# Altium schematic sheet wireless.SchDoc: Bison-Board
size A4; DrawnBy: mzy2364; Revision: V1.4
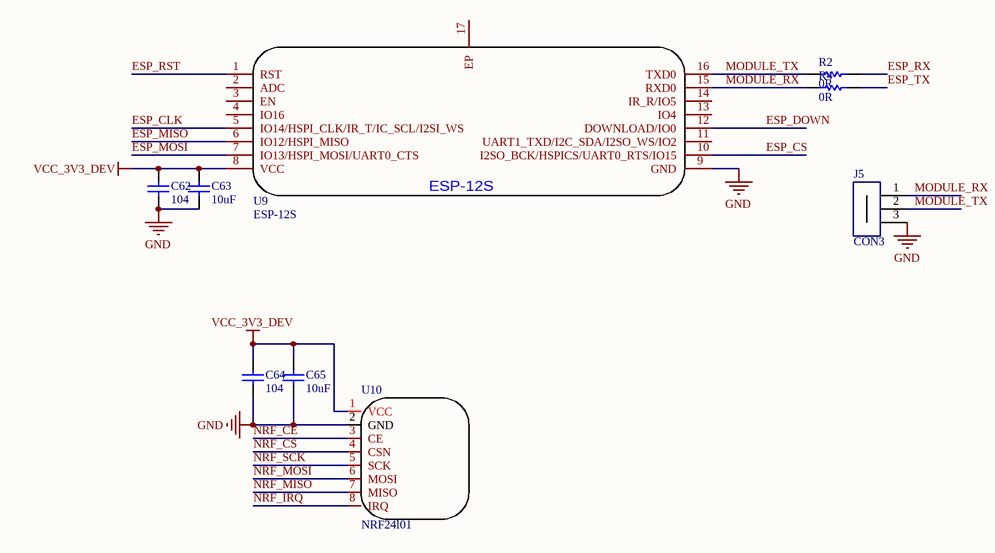
[diagram p0: wireless.SchDoc]

## Parts
C62  104  [C 0603]
C63  10uF  [C 0603]
C64  104  [C 0603]
C65  10uF  [C 0603]
J5  CON3  [SMD_3P-1.25]
R2  0R  [R 0603]
R4  0R  [R 0603]
U9  ESP-12S  [ESP-12S]
U10  NRF24l01  [NRF24l01]

## Nets
GND: C62.2 C63.2 C64.2 C65.2 J5.3 U9.9(GND) U10.2(GND)
VCC_3V3_DEV: C62.1 C63.1 C64.1 C65.1 U9.8(VCC) U10.1(VCC)
ESP_CLK: U9.5(IO14/HSPI_CLK/IR_T/IC_SCL/I2SI_WS)
ESP_CS: U9.10(I2SO_BCK/HSPICS/UART0_RTS/IO15)
ESP_DOWN: U9.12(DOWNLOAD/IO0)
ESP_MISO: U9.6(IO12/HSPI_MISO)
ESP_MOSI: U9.7(IO13/HSPI_MOSI/UART0_CTS)
ESP_RST: U9.1(RST)
ESP_RX: R2.2
ESP_TX: R4.2
MODULE_RX: J5.1 R4.1 U9.15(RXD0)
MODULE_TX: J5.2 R2.1 U9.16(TXD0)
NRF_CE: U10.3(CE)
NRF_CS: U10.4(CSN)
NRF_IRQ: U10.8(IRQ)
NRF_MISO: U10.7(MISO)
NRF_MOSI: U10.6(MOSI)
NRF_SCK: U10.5(SCK)

Not connected (* = marked no-connect by the designer): U9 2(ADC) 3(EN) 4(IO16) 11(UART1_TXD/I2C_SDA/I2SO_WS/IO2) 13(IO4) 14(IR_R/IO5) 17(EP)

## Library data of the parts
C62-C65 = CAP
R2 R4 = RES